# Altium schematic sheet RADG-USB-S04-V00.SchDoc: RADG USB (USB-C, ESD Protection)
size A3; DrawnBy: Jonn Dillon; DocumentNumber: 5; SheetNumber: 6; SheetTotal: 6; Version: 00; Project: QUTMS RADIO GPS; PageSetup: Record=PageOptions|CenterHorizontal=True|CenterVertical=True|PrintScale=0.97|XCorrection=1.00|YCorrection=1.00|PrintKind=0|BorderSize=5000000|LeftOffset=0|BottomOffset=0|Orientation=2|PaperLength=1000|PaperWidth=1000|Scale=100|PaperSource=7|PrintQuality=-4|MediaType=1|DitherType=10|PaperKind=A4|PrintScaleMode=1
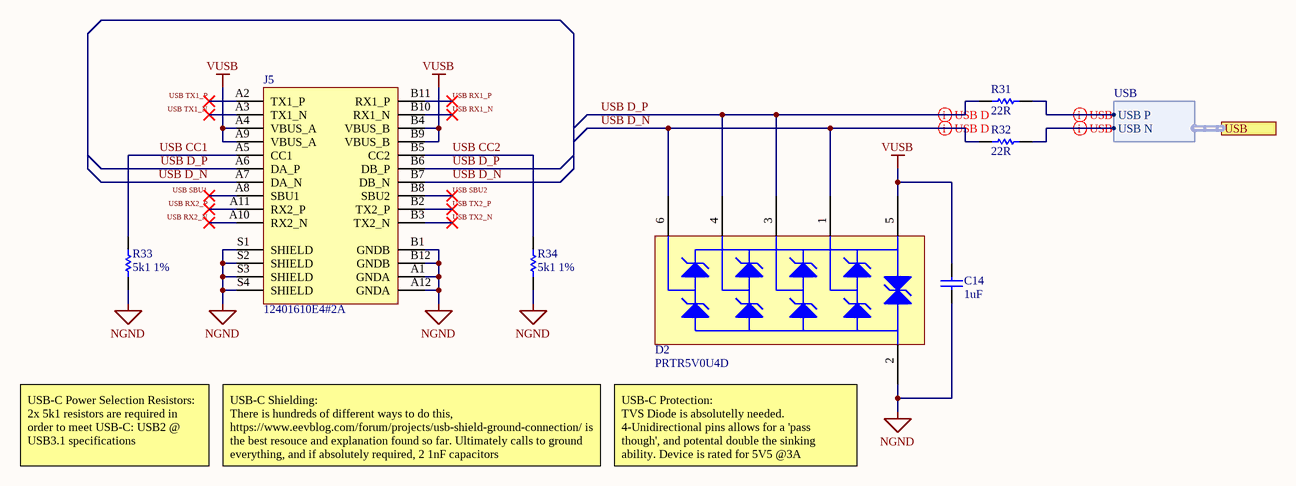
[diagram p0: RADG-USB-S04-V00.SchDoc]

## Parts
C14  1uF  [Cap_Ceramic_0603]
D2  PRTR5V0U4D  [SC-47]
J5  12401610E4#2A  [12401610E4#2A]
R31  22R  [Res_ThinFilm_0603]
R32  22R  [Res_ThinFilm_0603]
R33  5k1 1%  [Res_ThinFilm_0603]
R34  5k1 1%  [Res_ThinFilm_0603]

## Ports
USB (harness USB)

## Harnesses
USB: USB P, USB N

## Nets
NGND: C14.1 D2.2(GND) J5.A1(GNDA) J5.A12(GNDA) J5.B1(GNDB) J5.B12(GNDB) J5.S1(SHIELD) J5.S2(SHIELD) J5.S3(SHIELD) J5.S4(SHIELD) R33.1 R34.1
VUSB: C14.2 D2.5(VCC) J5.A4(VBUS_A) J5.A9(VBUS_A) J5.B4(VBUS_B) J5.B9(VBUS_B)
USB CC1: J5.A5(CC1) R33.2
USB CC2: J5.B5(CC2) R34.2
USB D_N: D2.1(P1) D2.6(P4) J5.A7(DA_N) J5.B7(DB_N) R32.1
USB D_P: D2.3(P2) D2.4(P3) J5.A6(DA_P) J5.B6(DB_P) R31.1
USB RX1_N: J5.B10(RX1_N)
USB RX1_P: J5.B11(RX1_P)
USB RX2_N: J5.A10(RX2_N)
USB RX2_P: J5.A11(RX2_P)
USB SBU1: J5.A8(SBU1)
USB SBU2: J5.B8(SBU2)
USB TX1_N: J5.A3(TX1_N)
USB TX1_P: J5.A2(TX1_P)
USB TX2_N: J5.B3(TX2_N)
USB TX2_P: J5.B2(TX2_P)
NetR31_2: R31.2 ; port USB.USB P
NetR32_2: R32.2 ; port USB.USB N

## Layout directives
differential pair: NetR31_2, NetR32_2, USB D_N, USB D_P

## Notes on the sheet
- USB-C Power Selection Resistors:
  2x 5k1 resistors are required in order to meet USB-C: USB2 @ USB3.1 specifications
- USB-C Shielding:
  There is hundreds of different ways to do this, https://www.eevblog.com/forum/projects/usb-shield-ground-connection/ is the best resouce and explanation found so far. Ultimately calls to ground everything, and if absolutely required, 2 1nF capacitors
- (near D2) USB-C Protection:
  TVS Diode is absolutelly needed. 4-Unidirectional pins allows for a 'pass though', and potental double the sinking ability. Device is rated for 5V5 @3A
- Revision History:
- Sheet Title:
- Rev
- Date
- Description
- Project:
- Size:
- Drawn By:
- A3
- Number:
- Revision:
- Sheet
- Version:
- of
- QUT Motorsport
- O-120, Gardens Point
- 2 George Street
- Brisbane, QLD 4000
- Australia
- Print Date:
- Print Time:
- File Name:

## Library data of the parts
C14 = 1uF 25V 5% X7R 0603: Capacitor, Ceramic, SMD, 1uF, 25V, 5%, X7R, 0603
D2 = PRTR5V0U4D: Clamp Ipp Tvs Diode Surface Mount 6-TSOP
J5 = 12401610E4#2A: USB-C (USB TYPE-C) USB 3.2 Gen 2 (USB 3.1 Gen 2, Superspeed + (USB 3.1)) Receptacle Connector 24 Position Surface Mount, Right Angle; Through Hole
R31 R32 = 22R 5% 0603: Resistor, SMD, 22R, 0.1W, 5%, 0603
R33 R34 = 5k1 1% 0603: Resistor, SMD, 5k1, 0.1W, 1%, 0603